# Altium schematic sheet BB_cape.SchDoc
size A4
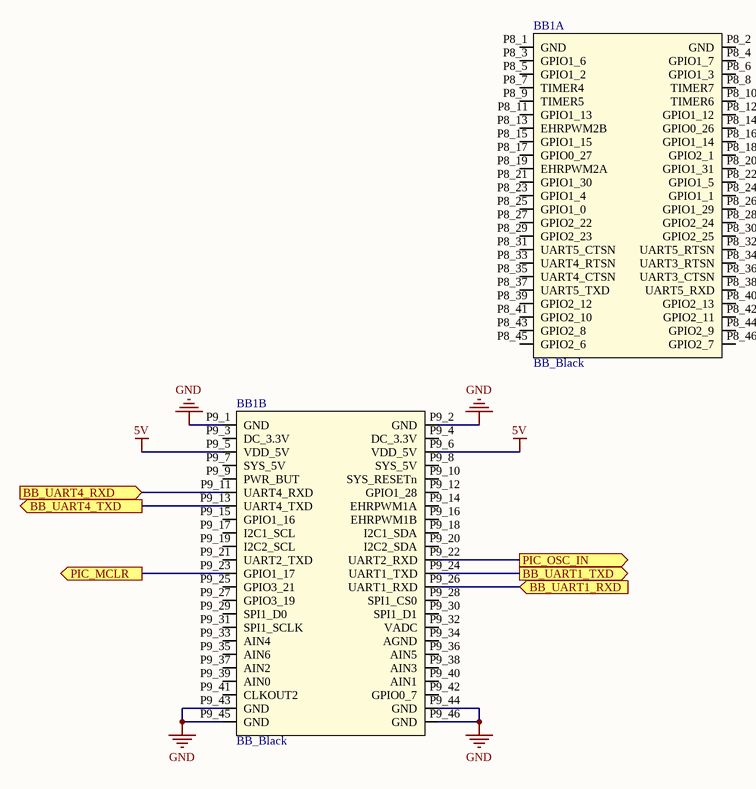
[diagram p0: BB_cape.SchDoc]

## Parts
BB1  BB_Black  [BB_Black_Above]  (parts A,B of 2)

## Ports
BB_UART1_RXD (in), BB_UART1_TXD (out), BB_UART4_RXD (in), BB_UART4_TXD (out), PIC_MCLR (out), PIC_OSC_IN (out)

## Nets
5V: BB1.P9_5(VDD_5V) BB1.P9_6(VDD_5V)
GND: BB1.P9_1(GND) BB1.P9_2(GND) BB1.P9_43(GND) BB1.P9_44(GND) BB1.P9_45(GND) BB1.P9_46(GND)
BB_UART1_RXD: BB1.P9_26(UART1_RXD) ; port BB_UART1_RXD
BB_UART1_TXD: BB1.P9_24(UART1_TXD) ; port BB_UART1_TXD
BB_UART4_RXD: BB1.P9_11(UART4_RXD) ; port BB_UART4_RXD
BB_UART4_TXD: BB1.P9_13(UART4_TXD) ; port BB_UART4_TXD
PIC_MCLR: BB1.P9_23(GPIO1_17) ; port PIC_MCLR
PIC_OSC_IN: BB1.P9_22(UART2_RXD) ; port PIC_OSC_IN

Not connected (* = marked no-connect by the designer): BB1 P8_1(GND) P8_2(GND) P8_3(GPIO1_6) P8_4(GPIO1_7) P8_5(GPIO1_2) P8_6(GPIO1_3) P8_7(TIMER4) P8_8(TIMER7) P8_9(TIMER5) P8_10(TIMER6) P8_11(GPIO1_13) P8_12(GPIO1_12) P8_13(EHRPWM2B) P8_14(GPIO0_26) P8_15(GPIO1_15) P8_16(GPIO1_14) P8_17(GPIO0_27) P8_18(GPIO2_1) P8_19(EHRPWM2A) P8_20(GPIO1_31) P8_21(GPIO1_30) P8_22(GPIO1_5) P8_23(GPIO1_4) P8_24(GPIO1_1) P8_25(GPIO1_0) P8_26(GPIO1_29) P8_27(GPIO2_22) P8_28(GPIO2_24) P8_29(GPIO2_23) P8_30(GPIO2_25) P8_31(UART5_CTSN) P8_32(UART5_RTSN) P8_33(UART4_RTSN) P8_34(UART3_RTSN) P8_35(UART4_CTSN) P8_36(UART3_CTSN) P8_37(UART5_TXD) P8_38(UART5_RXD) P8_39(GPIO2_12) P8_40(GPIO2_13) P8_41(GPIO2_10) P8_42(GPIO2_11) P8_43(GPIO2_8) P8_44(GPIO2_9) P8_45(GPIO2_6) P8_46(GPIO2_7) P9_3(DC_3.3V) P9_4(DC_3.3V) P9_7(SYS_5V) P9_8(SYS_5V) P9_9(PWR_BUT) P9_10(SYS_RESETn) P9_12(GPIO1_28) P9_14(EHRPWM1A) P9_15(GPIO1_16) P9_16(EHRPWM1B) P9_17(I2C1_SCL) P9_18(I2C1_SDA) P9_19(I2C2_SCL) P9_20(I2C2_SDA) P9_21(UART2_TXD) P9_25(GPIO3_21) P9_27(GPIO3_19) P9_28(SPI1_CS0) P9_29(SPI1_D0) P9_30(SPI1_D1) P9_31(SPI1_SCLK) P9_32(VADC) P9_33(AIN4) P9_34(AGND) P9_35(AIN6) P9_36(AIN5) P9_37(AIN2) P9_38(AIN3) P9_39(AIN0) P9_40(AIN1) P9_41(CLKOUT2) P9_42(GPIO0_7)